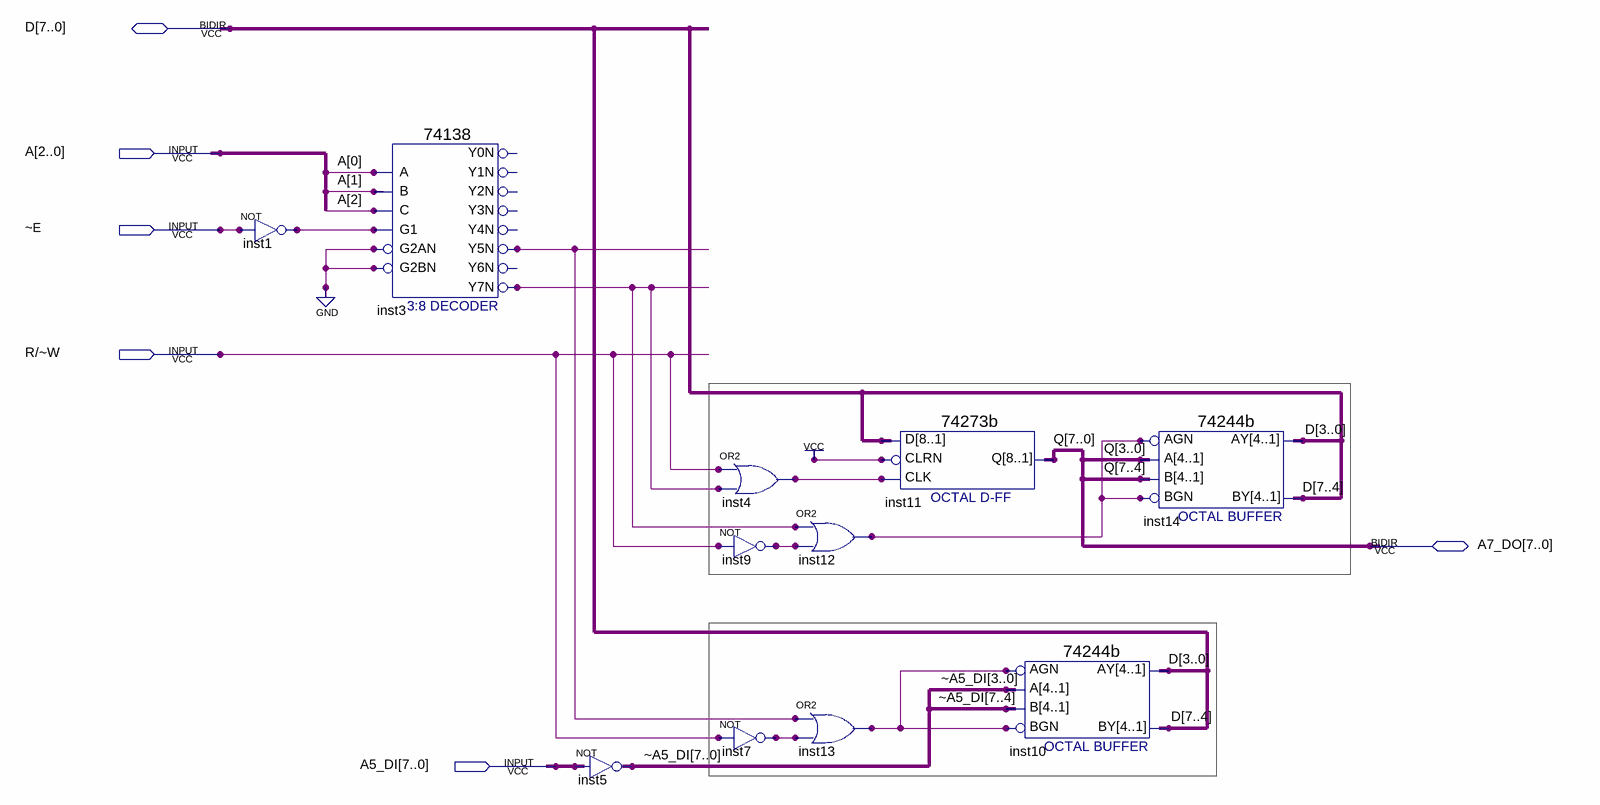
[diagram p0: schematic sheet]
// Quartus schematic CPLD_design.bdf as structural Verilog: 11 symbols, 6 pins
module CPLD_design (
  input  [2:0] A,
  input  \~E ,
  input  \R/~W ,
  input  [7:0] A5_DI,
  inout  [7:0] D,
  inout  [7:0] A7_DO
);

  wire inst1_out, inst3_y5n, inst3_y7n, inst4_out, inst7_out, inst9_out, inst12_out, inst13_out;
  wire [7:0] \~A5_DI ;

  not inst1 (inst1_out, \~E );
  \74138  inst3 (
    .A(A[0]), .B(A[1]), .G1(inst1_out), .C(A[2]), .G2AN(1'b0), .G2BN(1'b0), .Y5N(inst3_y5n), .Y7N(inst3_y7n));  // open: Y0N, Y1N, Y2N, Y3N, Y4N, Y6N
  assign \~A5_DI  = ~A5_DI;  // NOT inst5, 8 bits wide
  or inst4 (inst4_out, \R/~W , inst3_y7n);
  not inst9 (inst9_out, \R/~W );
  not inst7 (inst7_out, \R/~W );
  or inst12 (inst12_out, inst3_y7n, inst9_out);
  or inst13 (inst13_out, inst3_y5n, inst7_out);
  \74273b  inst11 (.CLK(inst4_out), .D(D), .CLRN(1'b1), .Q(A7_DO));
  \74244b  inst10 (.AGN(inst13_out), .B(\~A5_DI [7:4]), .BGN(inst13_out), .A(\~A5_DI [3:0]), .AY(D[3:0]), .BY(D[7:4]));
  \74244b  inst14 (.AGN(inst12_out), .B(A7_DO[7:4]), .BGN(inst12_out), .A(A7_DO[3:0]), .AY(D[3:0]), .BY(D[7:4]));

  // Other names for the same wires on the sheet: Q[7:0] = A7_DO
endmodule
